# Altium project ORBIT_PCB.PrjPcb
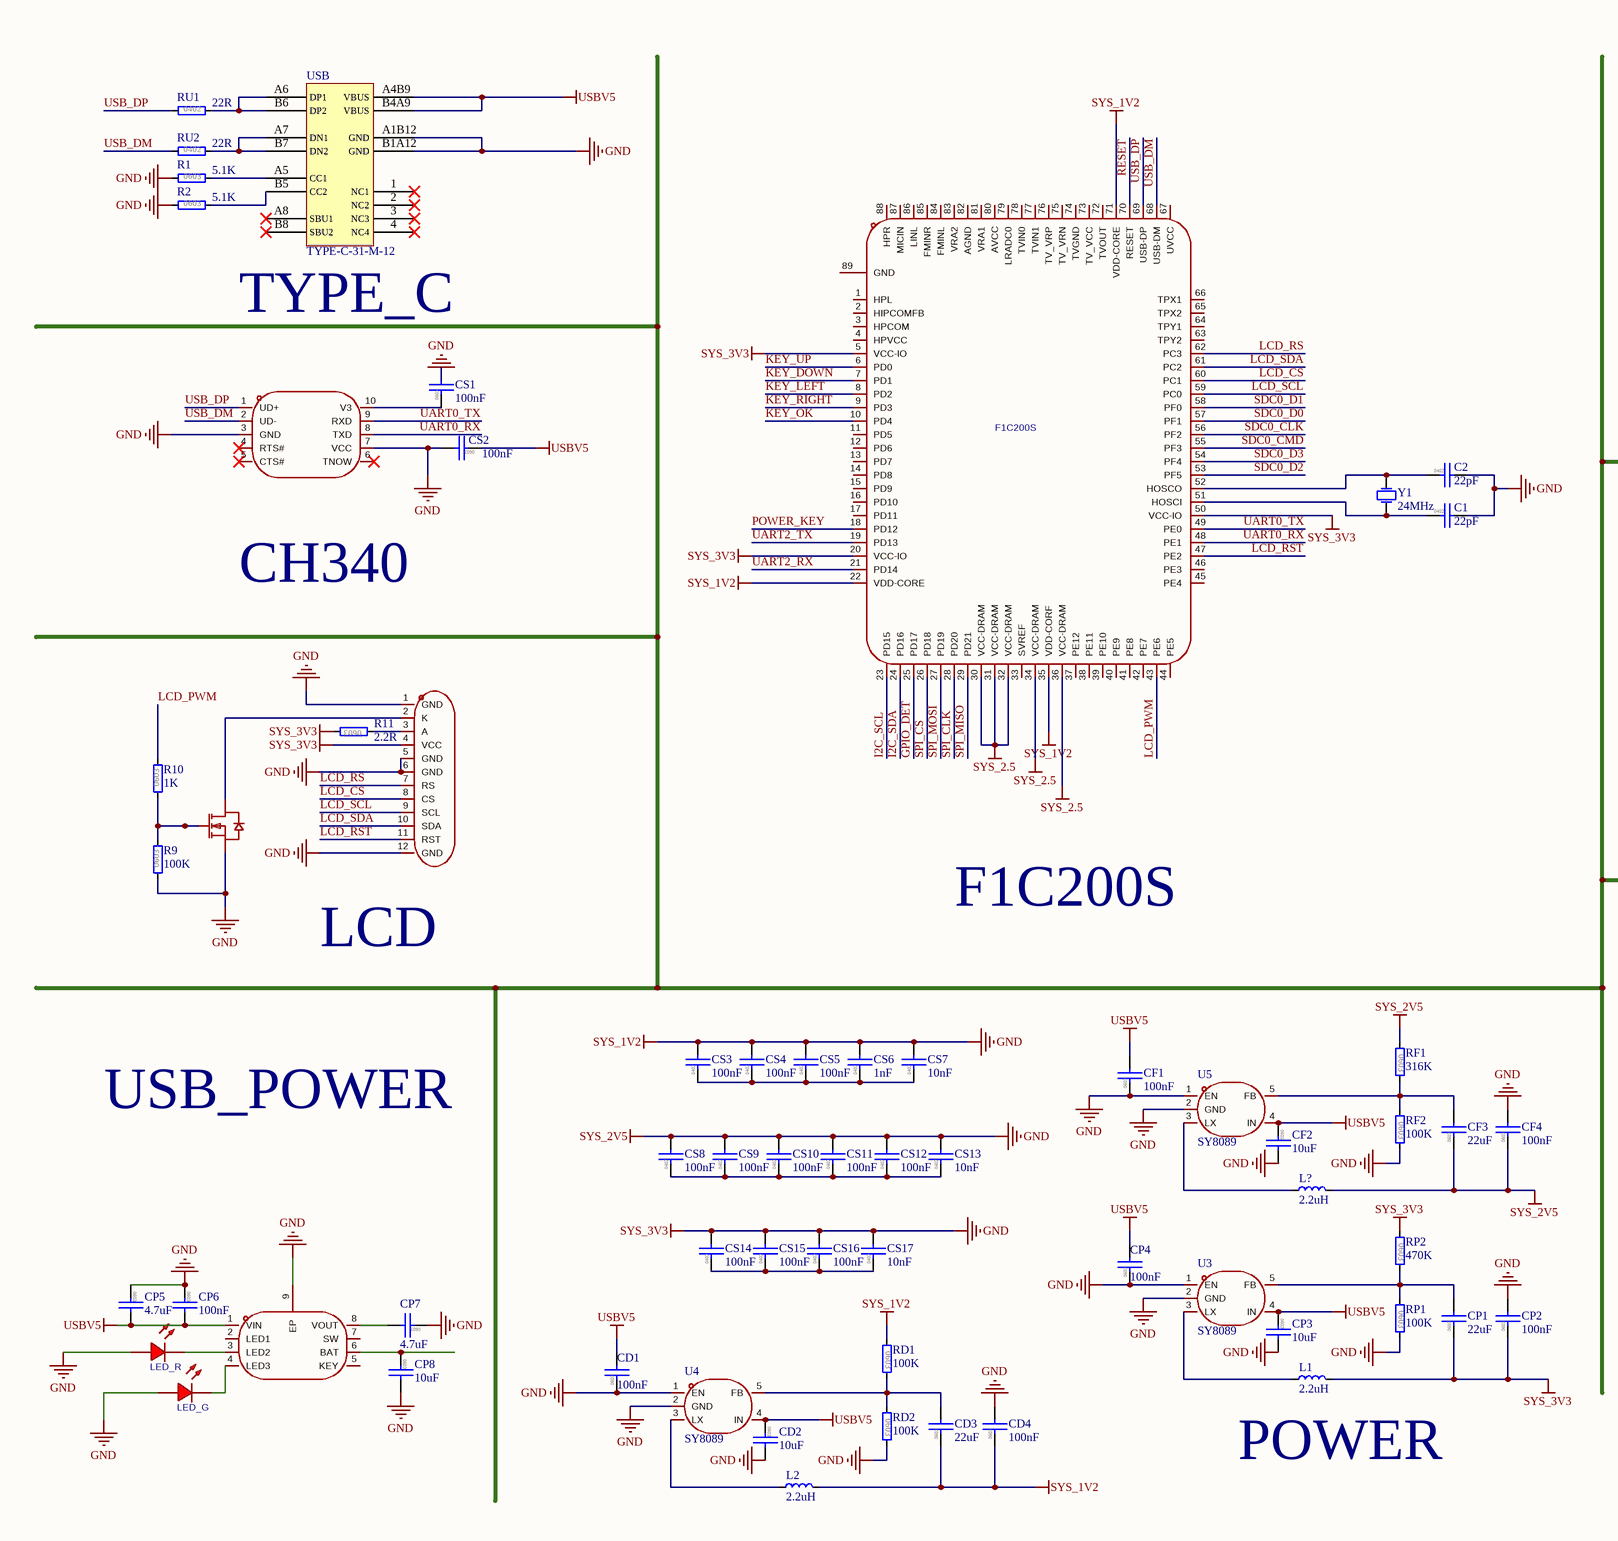
[diagram p0: Sheet1.SchDoc, left]
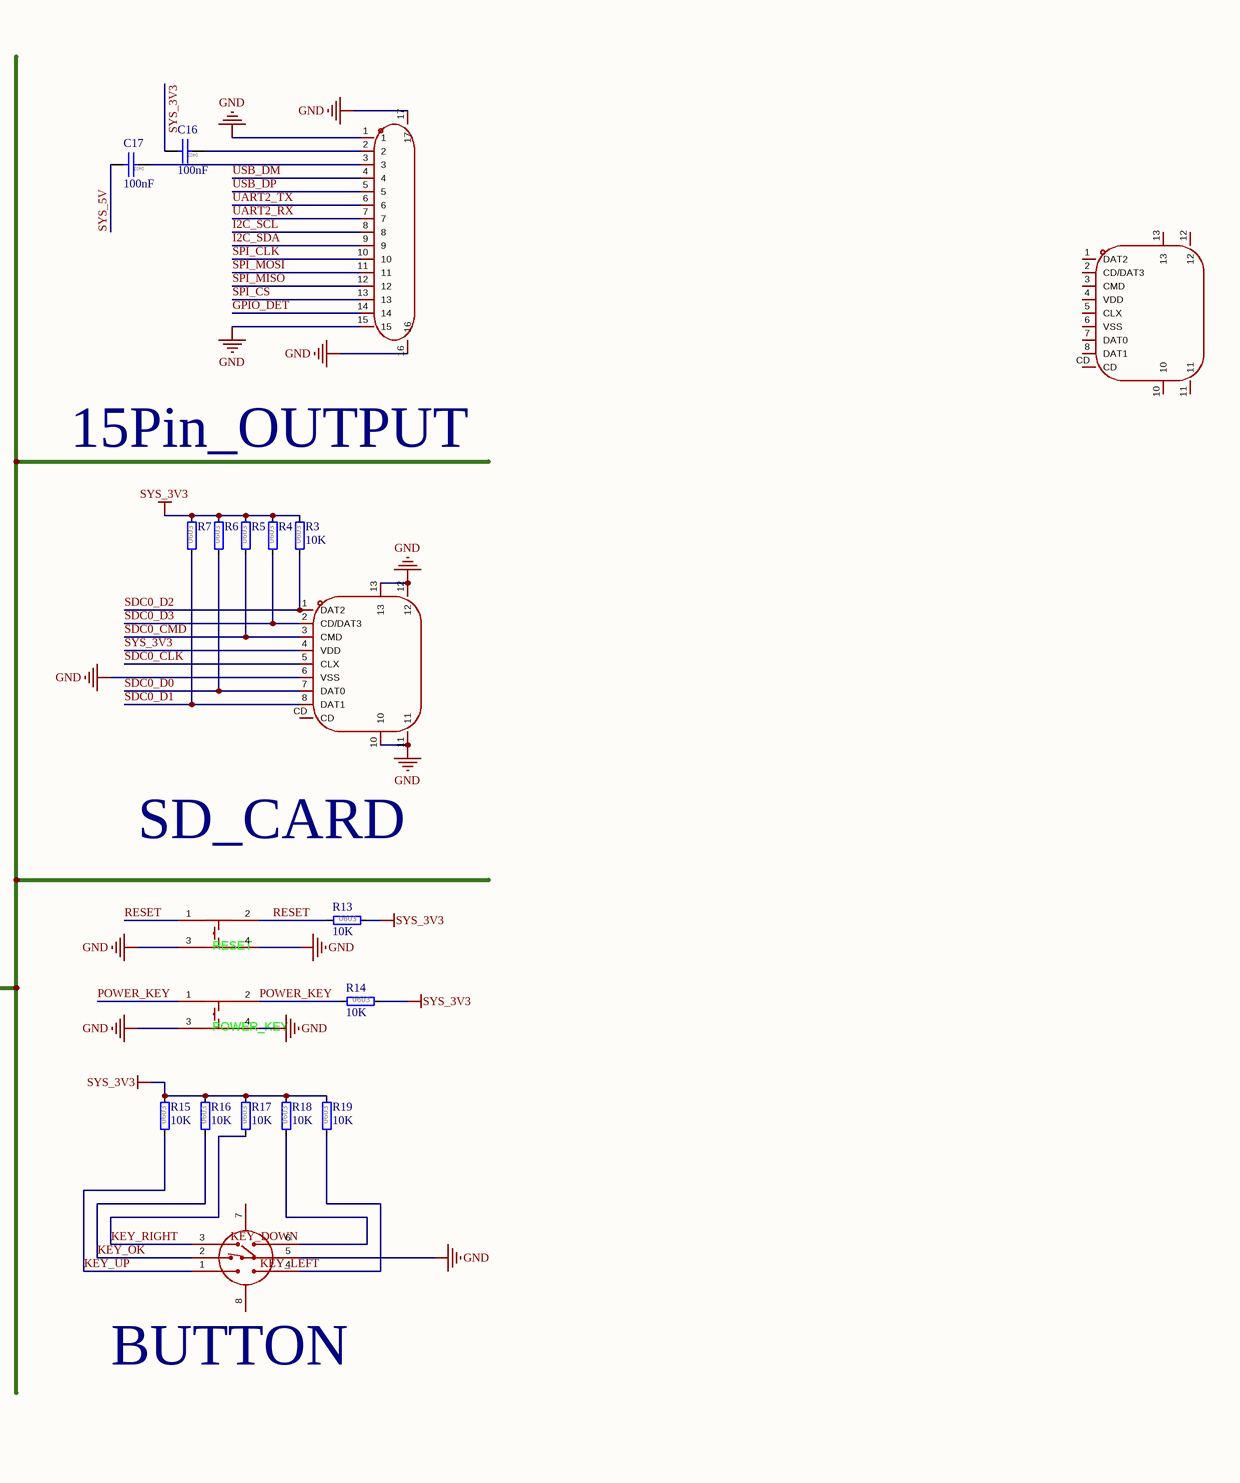
[diagram p1: Sheet1.SchDoc, right]
1 sheet, 83 parts. Net scope: global (net labels, ports and power ports of the same name join across sheets).
Board file: PCB1.PcbDoc

## Sheet Sheet1.SchDoc
size A3; SheetNumber: 1; SheetTotal: 1

### Parts
(Parts that share a designator on the sheet are numbered #1, #2 ... from top to bottom, then left to right.)
C1  22pF  [0402C]
C2  22pF  [0402C]
C16  100nF  [0402C]
C17  100nF  [0402C]
CARD??#1  TF PUSH  (value not drawn)
CARD??#2  TF PUSH  (value not drawn)
CD1  100nF  [0603C]
CD2  10uF  [0603C]
CD3  22uF  [0603C]
CD4  100nF  [0603C]
CF1  100nF  [0603C]
CF2  10uF  [0603C]
CF3  22uF  [0603C]
CF4  100nF  [0603C]
CP1  22uF  [0603C]
CP2  100nF  [0603C]
CP3  10uF  [0603C]
CP4  100nF  [0603C]
CP5  4.7uF  [0603C]
CP6  100nF  [0603C]
CP7  4.7uF  [0603C]
CP8  10uF  [0603C]
CS1  100nF  [0603C]
CS2  100nF  [0603C]
CS3  100nF  [0402C]
CS4  100nF  [0402C]
CS5  100nF  [0402C]
CS6  1nF  [0402C]
CS7  10nF  [0402C]
CS8  100nF  [0402C]
CS9  100nF  [0402C]
CS10  100nF  [0402C]
CS11  100nF  [0402C]
CS12  100nF  [0402C]
CS13  10nF  [0402C]
CS14  100nF  [0402C]
CS15  100nF  [0402C]
CS16  100nF  [0402C]
CS17  10nF  [0402C]
F1C200S  F1C200S  [QFN-88_L10.0-W10.0-P0.40-BL-EP6.75]  (value not drawn)
L1  2.2uH  [CD43-N]
L2  2.2uH  [CD43-N]
L?  2.2uH  [CD43-N]
LED1  LED_R  [LED0402-RD_GREEN]
LED2  LED_G  [LED0402-RD_GREEN]
Q1  Si2302CDS-T1-GE3  (value not drawn)
R1  5.1K  [0603R]
R2  5.1K  [0603R]
R3  10K  [0603R]
R4  (no value)  [0603R]
R5  (no value)  [0603R]
R6  (no value)  [0603R]
R7  (no value)  [0603R]
R9  100K  [0603R]
R10  1K  [0603R]
R11  2.2R  [0603R]
R13  10K  [0603R]
R14  10K  [0603R]
R15  10K  [0603R]
R16  10K  [0603R]
R17  10K  [0603R]
R18  10K  [0603R]
R19  10K  [0603R]
RD1  100K  [0603R]
RD2  100K  [0603R]
RF1  316K  [0603R]
RF2  100K  [0603R]
RP1  100K  [0603R]
RP2  470K  [0603R]
RU1  22R  [0402R]
RU2  22R  [0402R]
SW1  RESET
SW2  POWER_KEY
SW??  TMHU13-050B2-R  (value not drawn)
U2  CH340E  (value not drawn)
U3  SY8089
U4  SY8089
U5  SY8089
U6  IP5306  (value not drawn)
U??#1  FPC-1.0FX-15PWCR-H20  (value not drawn)
U??#2  HS20BS097RX  (value not drawn)
USB  TYPE-C-31-M-12  [TYPE-C-31-M-12]
Y1  24MHz  [OSC_5032-2P]

### Nets
SYS_2.5: F1C200S.30(VCC-DRAM) F1C200S.31(VCC-DRAM) F1C200S.32(VCC-DRAM) F1C200S.34(VCC-DRAM) F1C200S.36(VCC-DRAM)
SYS_3V3: C1.2 C2.2 C16.2 CARD??#2.4(VDD) CARD??#2.6(VSS) CARD??#2.10 CARD??#2.11 CARD??#2.12 CARD??#2.13 CD1.1 CD2.2 CD3.1 CD4.1 CD4.2 CF1.1 CF2.2 CF3.1 CF4.1 CF4.2 CP1.1 CP2.1 CP2.2 CP3.2 CP4.1 CP5.1 CP6.1 CP7.1 CP8.2 CS1.2 CS2.2 CS3.2 CS4.2 CS5.2 CS6.2 CS7.2 CS8.2 CS9.2 CS10.2 CS11.2 CS12.2 CS13.2 CS14.2 CS15.2 CS16.2 CS17.2 F1C200S.5(VCC-IO) F1C200S.20(VCC-IO) F1C200S.22(VDD-CORE) F1C200S.35(VDD-CORF) F1C200S.50(VCC-IO) F1C200S.71(VDD-CORE) L1.2 L2.2 L?.2 LED1.2(A) LED2.2(A) Q1.2(S) R1.1 R2.1 R3.2 R4.2 R5.2 R6.2 R7.2 R9.1 R11.2 R13.2 R14.2 R15.2 R16.2 R17.2 R18.2 R19.2 RD1.1 RD2.2 RF1.1 RF2.2 RP1.2 RP2.1 SW1.3 SW1.4 SW2.3 SW2.4 SW??.5 U2.3(GND) U2.7(VCC) U3.1(EN) U3.2(GND) U4.1(EN) U4.2(GND) U5.1(EN) U5.2(GND) U6.9(EP) U??#1.1 U??#1.15 U??#1.16 U??#1.17 U??#2.1(GND) U??#2.4(VCC) U??#2.5(GND) U??#2.6(GND) U??#2.12(GND) USB.A1B12(GND) USB.B1A12(GND)  [also labelled GND, SYS_1V2, SYS_2V5]
USBV5: CD1.2 CD2.1 CF1.2 CF2.1 CP3.1 CP4.2 CP5.2 CP6.2 CS2.1 U3.4(IN) U4.4(IN) U5.4(IN) U6.1(VIN) USB.A4B9(VBUS) USB.B4A9(VBUS)
GPIO_DET: F1C200S.25(PD17) U??#1.14
I2C_SCL: F1C200S.23(PD15) U??#1.8
I2C_SDA: F1C200S.24(PD16) U??#1.9
KEY_DOWN: F1C200S.7(PD1) R18.1 SW??.6
KEY_LEFT: F1C200S.8(PD2) R19.1 SW??.4
KEY_OK: F1C200S.10(PD4) R16.1 SW??.2
KEY_RIGHT: F1C200S.9(PD3) R17.1 SW??.3
KEY_UP: F1C200S.6(PD0) R15.1 SW??.1
LCD_CS: F1C200S.60(PC1) U??#2.8(CS)
LCD_PWM: F1C200S.43(PE6) R10.2
LCD_RS: F1C200S.62(PC3) U??#2.7(RS)
LCD_RST: F1C200S.47(PE2) U??#2.11(RST)
LCD_SCL: F1C200S.59(PC0) U??#2.9(SCL)
LCD_SDA: F1C200S.61(PC2) U??#2.10(SDA)
POWER_KEY: F1C200S.18(PD12) R14.1 SW2.1 SW2.2
RESET: F1C200S.70(RESET) R13.1 SW1.1 SW1.2
SDC0_CLK: CARD??#2.5(CLX) F1C200S.56(PF2)
SDC0_CMD: CARD??#2.3(CMD) F1C200S.55(PF3) R5.1
SDC0_D0: CARD??#2.7(DAT0) F1C200S.57(PF1) R6.1
SDC0_D1: CARD??#2.8(DAT1) F1C200S.58(PF0) R7.1
SDC0_D2: CARD??#2.1(DAT2) F1C200S.53(PF5) R3.1
SDC0_D3: CARD??#2.2(CD/DAT3) F1C200S.54(PF4) R4.1
SPI_CLK: F1C200S.28(PD20) U??#1.10
SPI_CS: F1C200S.26(PD18) U??#1.13
SPI_MISO: F1C200S.29(PD21) U??#1.12
SPI_MOSI: F1C200S.27(PD19) U??#1.11
SYS_5V: C17.2
UART0_RX: F1C200S.48(PE1) U2.8(TXD)
UART0_TX: F1C200S.49(PE0) U2.9(RXD)
UART2_RX: F1C200S.21(PD14) U??#1.7
UART2_TX: F1C200S.19(PD13) U??#1.6
USB_DM: F1C200S.68(USB-DM) RU2.1 U2.2(UD-) U??#1.4
USB_DP: F1C200S.69(USB-DP) RU1.1 U2.1(UD+) U??#1.5
NetC1_1: C1.1 F1C200S.51(HOSCI) Y1.1(OSC1)
NetC2_1: C2.1 F1C200S.52(HOSCO) Y1.2(OSC2)
NetC16_1: C16.1 U??#1.2
NetC17_1: C17.1 U??#1.3
NetCD3_2: CD3.2 RD1.2 RD2.1 U4.5(FB)
NetCF3_2: CF3.2 RF1.2 RF2.1 U5.5(FB)
NetCP1_2: CP1.2 RP1.1 RP2.2 U3.5(FB)
NetCP7_2: CP7.2 U6.8(VOUT)
NetCP8_1: CP8.1 U6.6(BAT)
NetCS1_1: CS1.1 U2.10(V3)
NetCS3_1: CS3.1 CS4.1 CS5.1 CS6.1 CS7.1
NetCS8_1: CS8.1 CS9.1 CS10.1 CS11.1 CS12.1 CS13.1
NetCS14_1: CS14.1 CS15.1 CS16.1 CS17.1
NetL1_1: L1.1 U3.3(LX)
NetL2_1: L2.1 U4.3(LX)
NetL?_1: L?.1 U5.3(LX)
NetLED1_1: LED1.1(C) U6.3(LED2)
NetLED2_1: LED2.1(C) U6.4(LED3)
NetQ1_1: Q1.1(G) R9.2 R10.1
NetQ1_3: Q1.3(D) U??#2.2(K)
NetR1_2: R1.2 USB.A5(CC1)
NetR2_2: R2.2 USB.B5(CC2)
NetR11_1: R11.1 U??#2.3(A)
NetRU1_2: RU1.2 USB.A6(DP1) USB.B6(DP2)
NetRU2_2: RU2.2 USB.A7(DN1) USB.B7(DN2)

Not connected (* = marked no-connect by the designer): CARD??#1 1(DAT2) 2(CD/DAT3) 3(CMD) 4(VDD) 5(CLX) 6(VSS) 7(DAT0) 8(DAT1) 10 11 12 13 CD; CARD??#2 CD; F1C200S 1(HPL) 2(HIPCOMFB) 3(HPCOM) 4(HPVCC) 11(PD5) 12(PD6) 13(PD7) 14(PD8) 15(PD9) 16(PD10) 17(PD11) 33(SVREF) 37(PE12) 38(PE11) 39(PE10) 40(PE9) 41(PE8) 42(PE7) 44(PE5) 45(PE4) 46(PE3) 63(TPY2) 64(TPY1) 65(TPX2) 66(TPX1) 67(UVCC) 72(TVOUT) 73(TV_VCC) 74(TVGND) 75(TV_VRN) 76(TV_VRP) 77(TVIN1) 78(TVIN0) 79(LRADC0) 80(AVCC) 81(VRA1) 82(AGND) 83(VRA2) 84(FMINL) 85(FMINR) 86(LINL) 87(MICIN) 88(HPR) 89(GND); SW?? 7 8; U2 4(RTS#)* 5(CTS#)* 6(TNOW)*; U6 2(LED1) 5(KEY) 7(SW); USB 1(NC1)* 2(NC2)* 3(NC3)* 4(NC4)* A8(SBU1)* B8(SBU2)*

### Notes on the sheet
- (near USB) TYPE_C
- 15Pin_OUTPUT
- CH340
- SD_CARD
- F1C200S
- (near U??#2) LCD
- USB_POWER
- (near SW??) BUTTON
- (near L1) POWER
- (in symbol Cap_0402) 0402
- (in symbol Cap_0603) 0603
- (in symbol Res_0402) 0402
- (in symbol Res_0603) 0603

### Library data of the parts
C1 C2 C16 C17 CS3-CS17 = Cap_0402: 贴片电容
CARD??#1 CARD??#2 = TF PUSH: tf卡座; Symbol: TF PUSH
CD1-CD4 CF1-CF4 CP1-CP8 CS1 CS2 = Cap_0603: 贴片电容
F1C200S = F1C200S: Manufacturer: Allwinner(全志); AddInBom: yes; ModelId: 9fbb6eebc76e44f2957bc86852556e57; ModelName: QFN-88_L10.0-W10.0-H0.8-P0.40-BL-EP; ModelTransform: 393.7,393.7,0,0,0,0,0,0,0; Device: F1C200S; LCSC Part Name: F1C200S; SupplierPart: C2879851; ManufacturerPart: F1C200S; Supplier Footprint: QFN-88; JLCPCB Part Class: 扩展库; Datasheet: https://atta.szlcsc.com/upload/public/pdf/source/20211016/C2879851_80200E64F493B5C5B5C583D1EECFE2F1.pdf; Supplier: LCSC; ConvertToPcb: yes; SymbolName: F1C200S; FootprintName: QFN-88_L10.0-W10.0-P0.40-BL-EP6.75
L1 L2 L? = Ind_CD43-10uH: 贴片功率电感-100
LED1 LED2 = LED_R: 发光颜色:红灯;; ConvertToPcb: yes; ModelId: ff479c6f784e45d5abe8f8ff531b4a70; ModelName: LED0402-RD_ORANGE; ModelTransform: 39.4,19.7,15.76,180,0,0,0,0,0; Symbol: LED_R; Device: LED_R; AddInBom: yes; Supplier Footprint: 0402; SupplierPart: C71911; JLCPCB Part Class: 扩展库; FootprintName: LED0402-RD_GREEN
R1-R7 R9-R11 R13-R19 RD1 RD2 RF1 RF2 RP1 RP2 = Res_0603: 贴片电阻-1/10W
RU1 RU2 = Res_0402: 贴片电阻
SW1 SW2 = TS-1186F-B-A: 侧边按钮; Symbol: TS-1186F-B-A
SW?? = TMHU13-050B2-R: 五向按钮; Symbol: TMHU13-050B2-R
U3-U5 = SY8089: C479074_DC-DC电源芯片_SY8089A1AAC
U6 = IP5306: 充电模块; Symbol: IP5306
U??#1 = FPC-1.0FX-15PWCR-H20: 15pin排线座; Symbol: FPC-1.0FX-15PWCR-H20
USB = TYPE-C-31-M-12: 韩国韩荣 USB Type-C 母座
Y1 = Osc_Pas-5032-2P: 无源晶振-贴片 5.0*3.2 mm
Q1 = Si2302CDS-T1-GE3: Symbol: Si2302CDS-T1-GE3
U2 = CH340E: Symbol: CH340E
U??#2 = HS20BS097RX: Symbol: HS20BS097RX